# Altium schematic sheet WiFiBoard.SchDoc
size A4; SheetNumber: 1; SheetTotal: 3
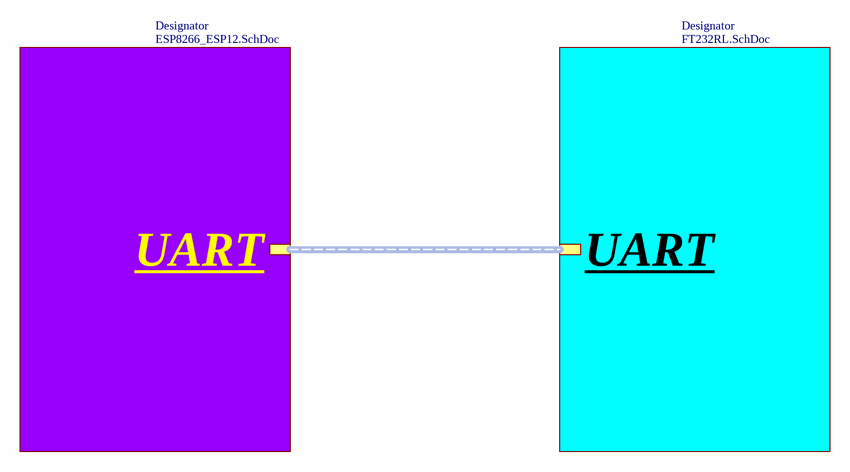
[diagram p0: WiFiBoard.SchDoc]

## Sub-sheets
Designator = ESP8266_ESP12.SchDoc: UART (harness UART)
Designator = FT232RL.SchDoc: UART (harness UART)